# Altium project LPCB235__RLOOP__FCU.PrjPCB (part 6 of 7)

## Sheet LPCB235 - ASI RS485.SchDoc
size A3; Address1: Factory 10; Address2: 9-13 Dingley Avenue, Dandeong, VICTORIA 3175, AUSTRALIA; DocumentNumber: 3; Revision: 1; SheetNumber: 3; SheetTotal: 37; Lockie__PCB_SUB_ASSEMBLY: ASI RS485 Link; Lockie__PCB_ASSEMBLY: FCU PCB; Lockie__LDL: LPCB235; Lockie__PCB_DESCRIPTION: Flight Control Unit
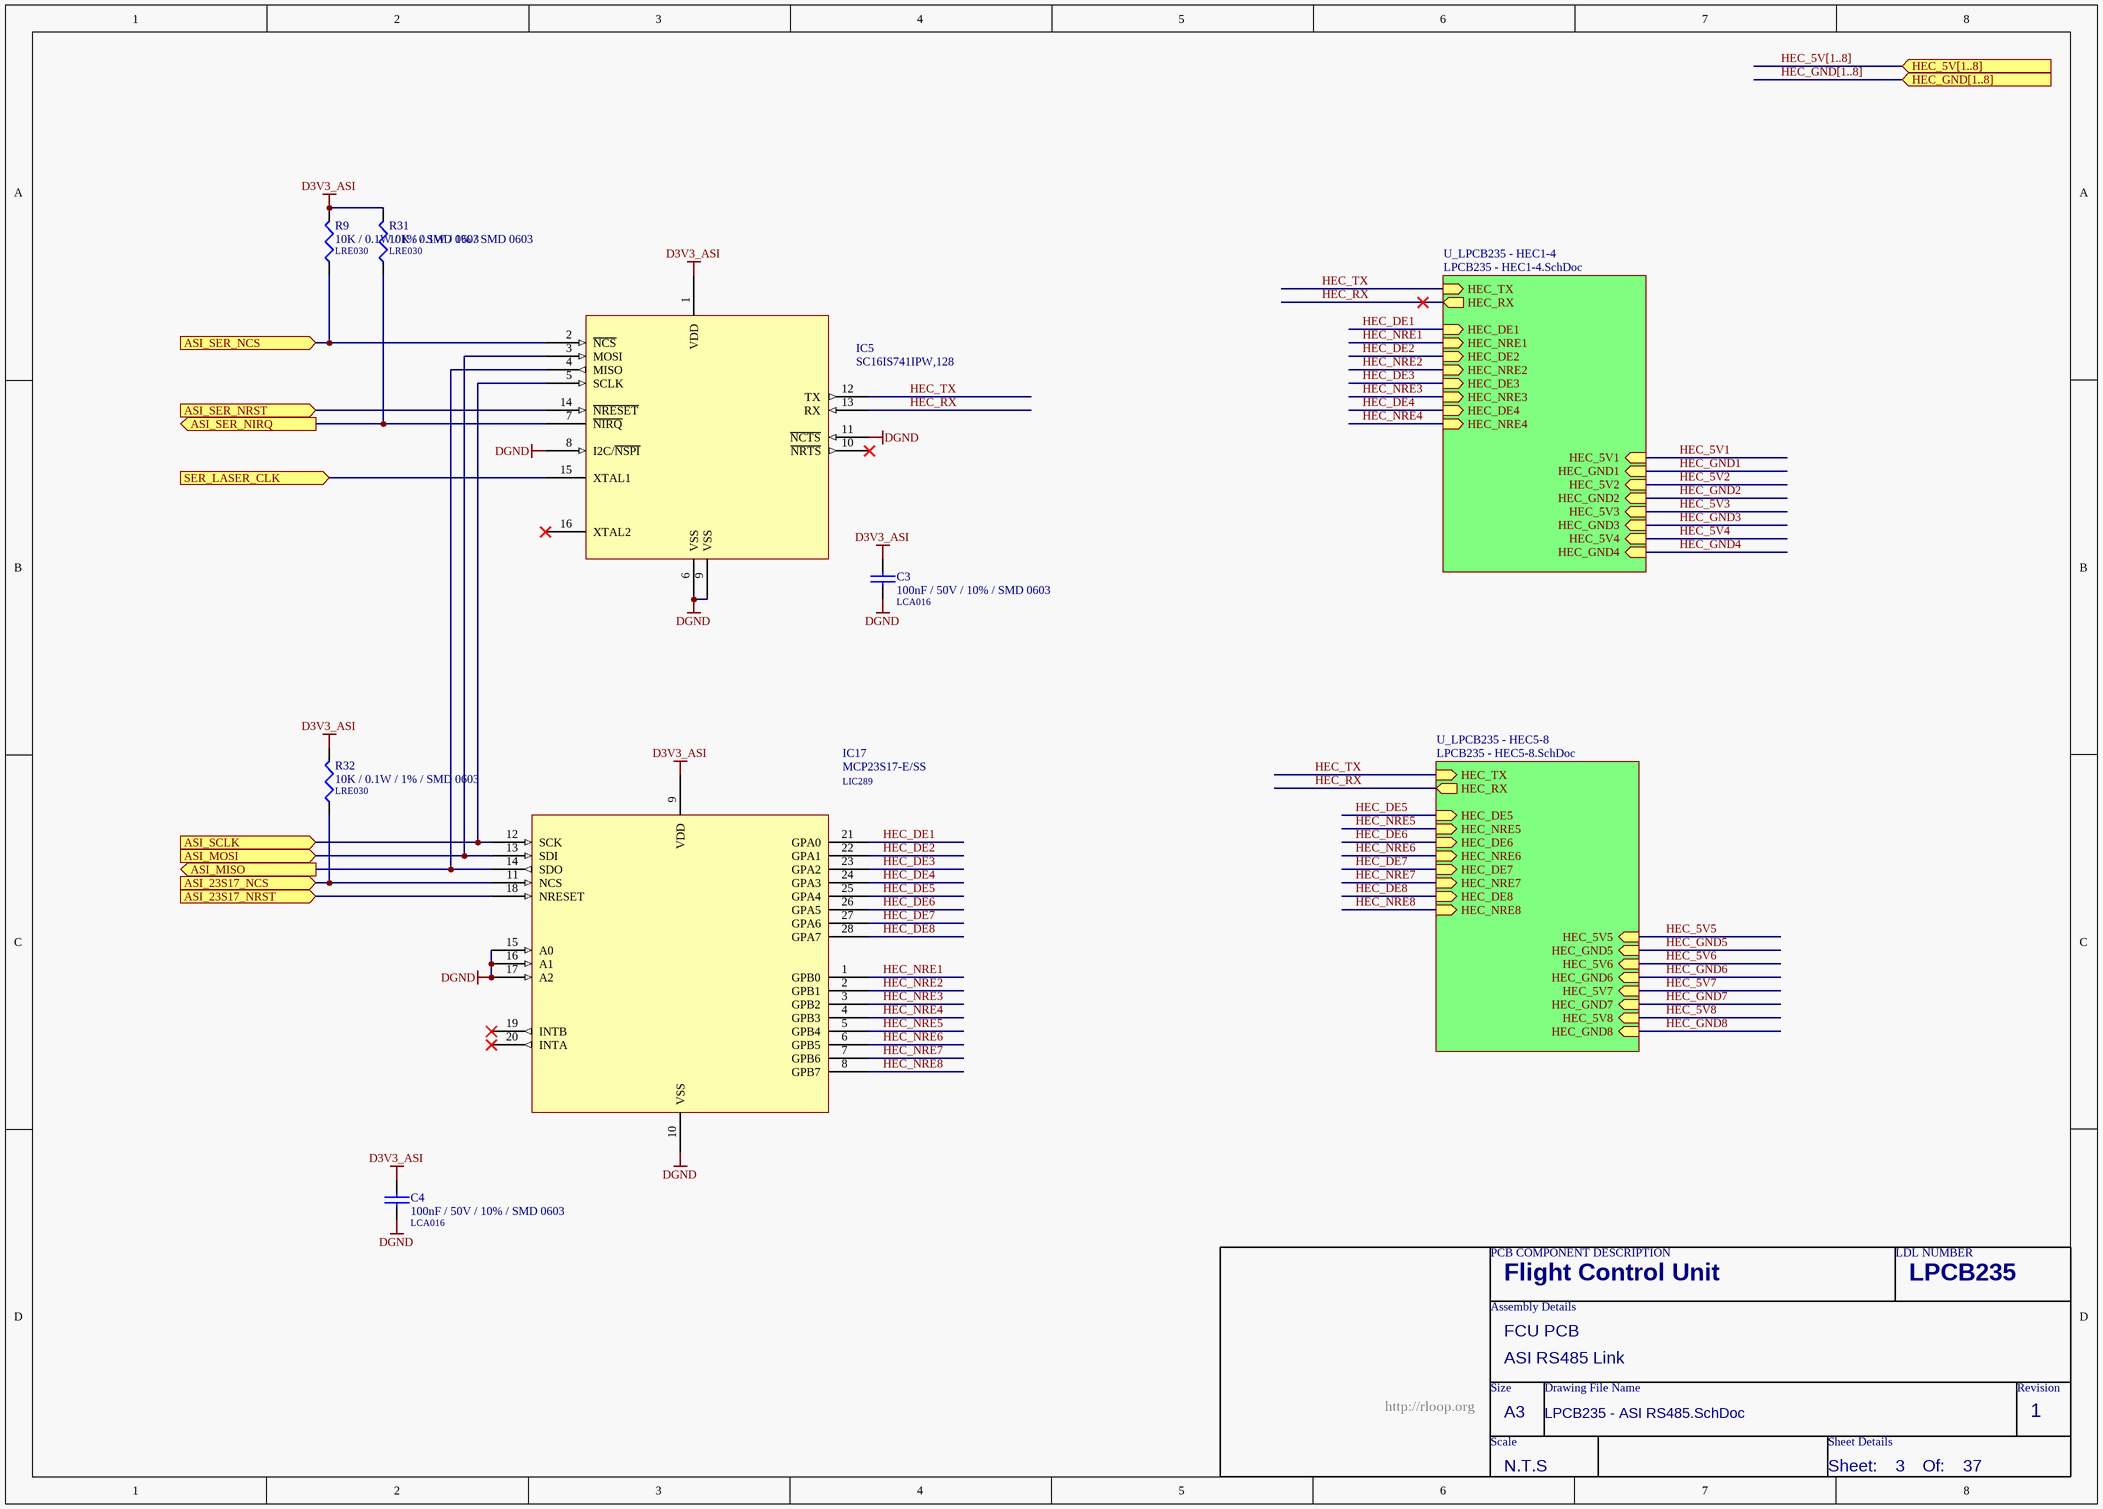
[diagram p34: LPCB235 - ASI RS485.SchDoc]

### Parts
C3  100nF / 50V / 10% / SMD 0603  LDL_NUMBER: LCA016  [LFP011__CC1608-0603-IPC7351_B]
C4  100nF / 50V / 10% / SMD 0603  LDL_NUMBER: LCA016  [LFP011__CC1608-0603-IPC7351_B]
IC5  SC16IS741IPW,128  [LFP049__TSSOP-16]
IC17  MCP23S17-E/SS  LDL_NUMBER: LIC289  [LFP050__SSOP28]
R9  10K / 0.1W / 1% / SMD 0603  LDL_NUMBER: LRE030  [LFP020__CR1608-0603-IPC7351_B]
R31  10K / 0.1W / 1% / SMD 0603  LDL_NUMBER: LRE030  [LFP020__CR1608-0603-IPC7351_B]
R32  10K / 0.1W / 1% / SMD 0603  LDL_NUMBER: LRE030  [LFP020__CR1608-0603-IPC7351_B]

### Sub-sheets
U_LPCB235 - HEC1-4 = LPCB235 - HEC1-4.SchDoc: HEC_RX (out), HEC_TX (in), HEC_DE1 (in), HEC_NRE1 (in), HEC_DE2 (in), HEC_NRE2 (in), HEC_DE3 (in), HEC_NRE3 (in), HEC_DE4 (in), HEC_NRE4 (in), HEC_5V1 (in), HEC_GND1 (in), HEC_5V2 (in), HEC_GND2 (in), HEC_5V3 (in), HEC_GND3 (in), HEC_5V4 (in), HEC_GND4 (in)
U_LPCB235 - HEC5-8 = LPCB235 - HEC5-8.SchDoc: HEC_RX (out), HEC_TX (in), HEC_DE5 (in), HEC_NRE5 (in), HEC_DE6 (in), HEC_NRE6 (in), HEC_DE7 (in), HEC_NRE7 (in), HEC_DE8 (in), HEC_NRE8 (in), HEC_5V5 (in), HEC_GND5 (in), HEC_5V6 (in), HEC_GND6 (in), HEC_5V7 (in), HEC_GND7 (in), HEC_5V8 (in), HEC_GND8 (in)

### Ports
ASI_23S17_NCS (in), ASI_23S17_NRST (in), ASI_MISO (out), ASI_MOSI (in), ASI_SCLK (in), ASI_SER_NCS (in), ASI_SER_NIRQ (out), ASI_SER_NRST (in), HEC_5V[1..8] (in), HEC_GND[1..8] (in), SER_LASER_CLK (in)

### Nets
D3V3_ASI: C3.1 C4.1 IC5.1(VDD) IC17.9(VDD) R9.2 R31.2 R32.2
DGND: C3.2 C4.2 IC5.6(VSS) IC5.8(I2C/~{NSPI}) IC5.9(VSS) IC5.11(~{NCTS}) IC17.10(VSS) IC17.15(A0) IC17.16(A1) IC17.17(A2)
ASI_23S17_NCS: IC17.11(NCS) R32.1 ; port ASI_23S17_NCS
ASI_23S17_NRST: IC17.18(NRESET) ; port ASI_23S17_NRST
ASI_MISO: IC5.4(MISO) IC17.14(SDO) ; port ASI_MISO
ASI_MOSI: IC5.3(MOSI) IC17.13(SDI) ; port ASI_MOSI
ASI_SCLK: IC5.5(SCLK) IC17.12(SCK) ; port ASI_SCLK
ASI_SER_NCS: IC5.2(~{NCS}) R9.1 ; port ASI_SER_NCS
ASI_SER_NIRQ: IC5.7(~{NIRQ}) R31.1 ; port ASI_SER_NIRQ
ASI_SER_NRST: IC5.14(~{NRESET}) ; port ASI_SER_NRST
HEC_DE1: IC17.21(GPA0) ; sheet U_LPCB235 - HEC1-4/HEC_DE1
HEC_DE2: IC17.22(GPA1) ; sheet U_LPCB235 - HEC1-4/HEC_DE2
HEC_DE3: IC17.23(GPA2) ; sheet U_LPCB235 - HEC1-4/HEC_DE3
HEC_DE4: IC17.24(GPA3) ; sheet U_LPCB235 - HEC1-4/HEC_DE4
HEC_DE5: IC17.25(GPA4) ; sheet U_LPCB235 - HEC5-8/HEC_DE5
HEC_DE6: IC17.26(GPA5) ; sheet U_LPCB235 - HEC5-8/HEC_DE6
HEC_DE7: IC17.27(GPA6) ; sheet U_LPCB235 - HEC5-8/HEC_DE7
HEC_DE8: IC17.28(GPA7) ; sheet U_LPCB235 - HEC5-8/HEC_DE8
HEC_NRE1: IC17.1(GPB0) ; sheet U_LPCB235 - HEC1-4/HEC_NRE1
HEC_NRE2: IC17.2(GPB1) ; sheet U_LPCB235 - HEC1-4/HEC_NRE2
HEC_NRE3: IC17.3(GPB2) ; sheet U_LPCB235 - HEC1-4/HEC_NRE3
HEC_NRE4: IC17.4(GPB3) ; sheet U_LPCB235 - HEC1-4/HEC_NRE4
HEC_NRE5: IC17.5(GPB4) ; sheet U_LPCB235 - HEC5-8/HEC_NRE5
HEC_NRE6: IC17.6(GPB5) ; sheet U_LPCB235 - HEC5-8/HEC_NRE6
HEC_NRE7: IC17.7(GPB6) ; sheet U_LPCB235 - HEC5-8/HEC_NRE7
HEC_NRE8: IC17.8(GPB7) ; sheet U_LPCB235 - HEC5-8/HEC_NRE8
HEC_RX: IC5.13(RX) ; sheet U_LPCB235 - HEC1-4/HEC_RX, sheet U_LPCB235 - HEC5-8/HEC_RX
HEC_TX: IC5.12(TX) ; sheet U_LPCB235 - HEC1-4/HEC_TX, sheet U_LPCB235 - HEC5-8/HEC_TX
SER_LASER_CLK: IC5.15(XTAL1) ; port SER_LASER_CLK

Not connected (* = marked no-connect by the designer): IC5 10(~{NRTS})* 16(XTAL2)*; IC17 19(INTB)* 20(INTA)*

### Buses and harness runs
bus HEC_5V[1..8] = port HEC_5V[1..8]
bus HEC_GND[1..8] = port HEC_GND[1..8]

### Notes on the sheet
- PCB COMPONENT DESCRIPTION
- LDL NUMBER
- Assembly Details
- Size
- Drawing File Name
- Revision
- http://rloop.org
- Scale
- A3
- Sheet Details
- N.T.S
- Sheet:
- Of:

### Library data of the parts
C3 C4 = 100nF / 50V / 10% / SMD 0603: as C113-C117 on sheet LPCB235 - SPI UART - GROUP B1; FMEDA__FUNCTION_IN_SYSTEM: *; FMEDA__OPERATING__VOLTAGE_TYP: 3.3
IC5 = SC16IS741IPW,128: as IC33 on sheet LPCB235 - SPI UART - GROUP B1; FMEDA__FUNCTION_IN_SYSTEM: *
IC17 = MCP23S17-E/SS: IC, SPI IO Expander, 16bit, SMD SSOP28 [LIC289]; FMEDA__OPERATING__TEMP_MIN: -20; FMEDA__OPERATING__TEMP_TYP: 27; FMEDA__OPERATING__TEMP_MAX: 50; FMEDA__OPERATING__VOLTAGE_MIN: 0; FMEDA__OPERATING__VOLTAGE_TYP: 3.3; FMEDA__CHANNEL: COM; FMEDA__FUNCTION_IN_SYSTEM: *; FMEDA__OPERATING__VOLTAGE_MAX: 3.3
R9 R31 R32 = 10K / 0.1W / 1% / SMD 0603: as R64 on sheet LPCB235 - SPI UART - GROUP B1; Value: 10K; FMEDA__OPERATING__POWER_MIN: 0; FMEDA__OPERATING__VOLTAGE_MAX: 0; FMEDA__OPERATING__VOLTAGE_MIN: 0; FMEDA__OPERATING__VOLTAGE_TYP: 0; FMEDA__FUNCTION_IN_SYSTEM: *

## Sheet LPCB235 - HEC1-4.SchDoc
size A3; Address1: Factory 10; Address2: 9-13 Dingley Avenue, Dandeong, VICTORIA 3175, AUSTRALIA; DocumentNumber: 4; Revision: 1; SheetNumber: 4; SheetTotal: 37; Lockie__PCB_SUB_ASSEMBLY: HEC 1-4; Lockie__PCB_ASSEMBLY: FCU PCB; Lockie__LDL: LPCB235; Lockie__PCB_DESCRIPTION: Flight Control Unit
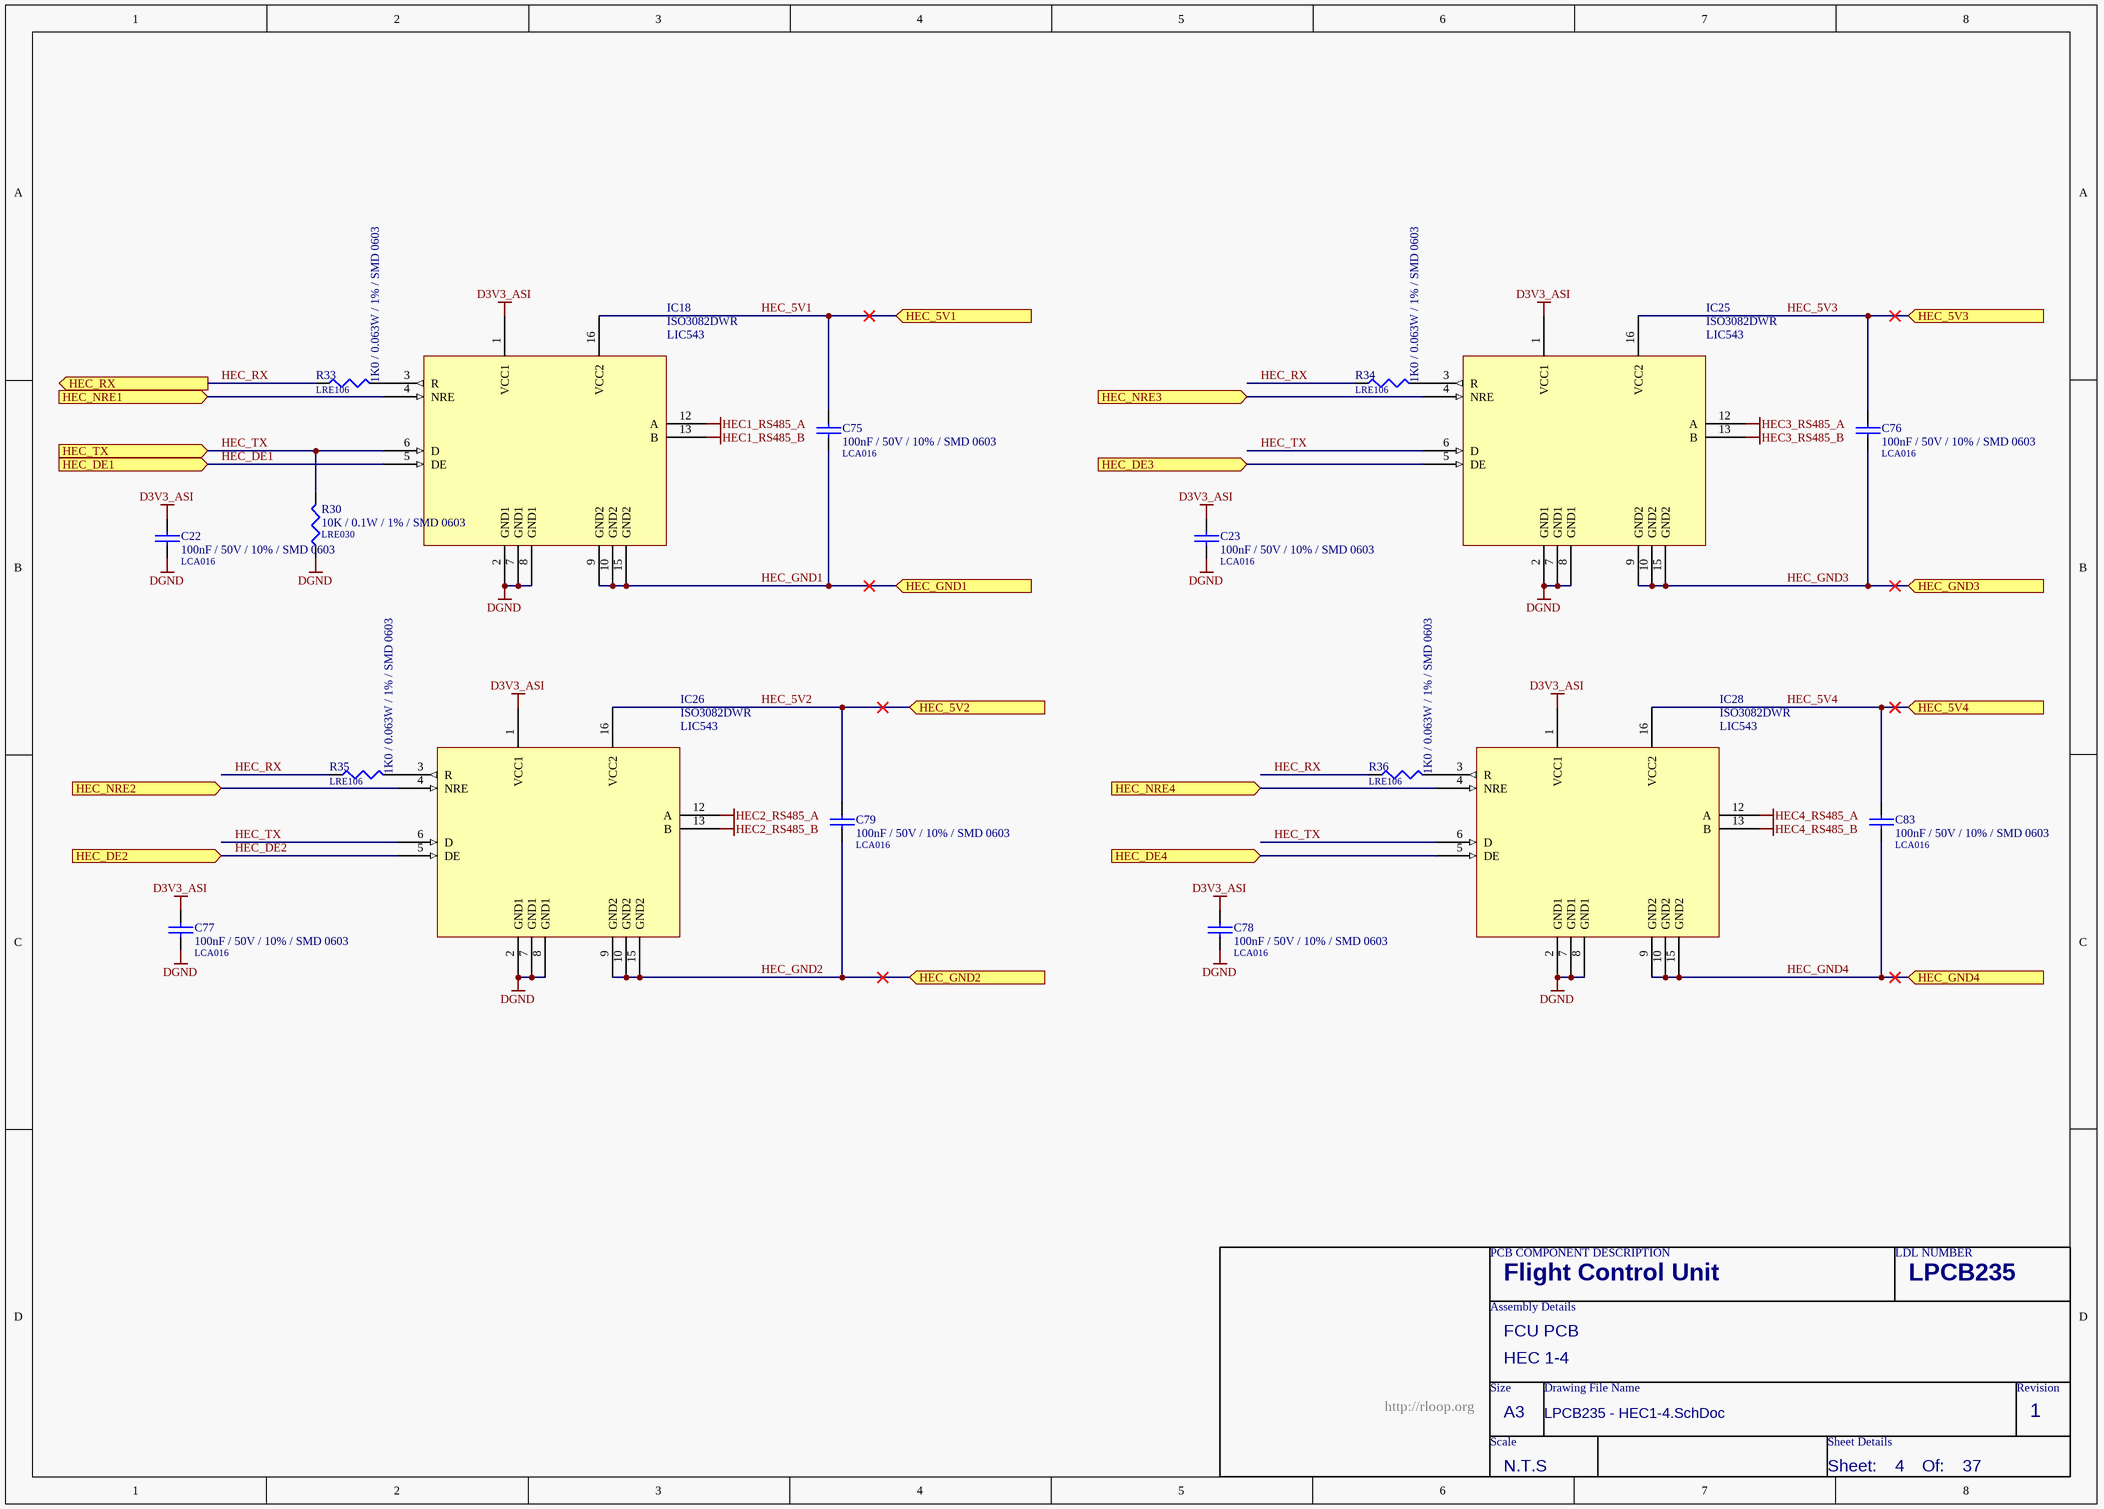
[diagram p35: LPCB235 - HEC1-4.SchDoc]

### Parts
C22  100nF / 50V / 10% / SMD 0603  LDL_NUMBER: LCA016  [LFP011__CC1608-0603-IPC7351_B]
C23  100nF / 50V / 10% / SMD 0603  LDL_NUMBER: LCA016  [LFP011__CC1608-0603-IPC7351_B]
C75  100nF / 50V / 10% / SMD 0603  LDL_NUMBER: LCA016  [LFP011__CC1608-0603-IPC7351_B]
C76  100nF / 50V / 10% / SMD 0603  LDL_NUMBER: LCA016  [LFP011__CC1608-0603-IPC7351_B]
C77  100nF / 50V / 10% / SMD 0603  LDL_NUMBER: LCA016  [LFP011__CC1608-0603-IPC7351_B]
C78  100nF / 50V / 10% / SMD 0603  LDL_NUMBER: LCA016  [LFP011__CC1608-0603-IPC7351_B]
C79  100nF / 50V / 10% / SMD 0603  LDL_NUMBER: LCA016  [LFP011__CC1608-0603-IPC7351_B]
C83  100nF / 50V / 10% / SMD 0603  LDL_NUMBER: LCA016  [LFP011__CC1608-0603-IPC7351_B]
IC18  ISO3082DWR  LDL_NUMBER: LIC543  [LFP068__SO-G16/G6.9]
IC25  ISO3082DWR  LDL_NUMBER: LIC543  [LFP068__SO-G16/G6.9]
IC26  ISO3082DWR  LDL_NUMBER: LIC543  [LFP068__SO-G16/G6.9]
IC28  ISO3082DWR  LDL_NUMBER: LIC543  [LFP068__SO-G16/G6.9]
R30  10K / 0.1W / 1% / SMD 0603  LDL_NUMBER: LRE030  [LFP020__CR1608-0603-IPC7351_B]
R33  1K0 / 0.063W / 1% / SMD 0603  LDL_NUMBER: LRE106  [LFP020__CR1608-0603-IPC7351_B]
R34  1K0 / 0.063W / 1% / SMD 0603  LDL_NUMBER: LRE106  [LFP020__CR1608-0603-IPC7351_B]
R35  1K0 / 0.063W / 1% / SMD 0603  LDL_NUMBER: LRE106  [LFP020__CR1608-0603-IPC7351_B]
R36  1K0 / 0.063W / 1% / SMD 0603  LDL_NUMBER: LRE106  [LFP020__CR1608-0603-IPC7351_B]

### Ports
HEC_5V1 (in), HEC_5V2 (in), HEC_5V3 (in), HEC_5V4 (in), HEC_DE1 (in), HEC_DE2 (in), HEC_DE3 (in), HEC_DE4 (in), HEC_GND1 (in), HEC_GND2 (in), HEC_GND3 (in), HEC_GND4 (in), HEC_NRE1 (in), HEC_NRE2 (in), HEC_NRE3 (in), HEC_NRE4 (in), HEC_RX (out), HEC_TX (in)

### Nets
D3V3_ASI: C22.1 C23.1 C77.1 C78.1 IC18.1(VCC1) IC25.1(VCC1) IC26.1(VCC1) IC28.1(VCC1)
DGND: C22.2 C23.2 C77.2 C78.2 IC18.2(GND1) IC18.7(GND1) IC18.8(GND1) IC25.2(GND1) IC25.7(GND1) IC25.8(GND1) IC26.2(GND1) IC26.7(GND1) IC26.8(GND1) IC28.2(GND1) IC28.7(GND1) IC28.8(GND1) R30.1
HEC1_RS485_A: IC18.12(A)
HEC1_RS485_B: IC18.13(B)
HEC2_RS485_A: IC26.12(A)
HEC2_RS485_B: IC26.13(B)
HEC3_RS485_A: IC25.12(A)
HEC3_RS485_B: IC25.13(B)
HEC4_RS485_A: IC28.12(A)
HEC4_RS485_B: IC28.13(B)
HEC_5V1: C75.1 IC18.16(VCC2) ; port HEC_5V1
HEC_5V2: C79.1 IC26.16(VCC2) ; port HEC_5V2
HEC_5V3: C76.1 IC25.16(VCC2) ; port HEC_5V3
HEC_5V4: C83.1 IC28.16(VCC2) ; port HEC_5V4
HEC_DE1: IC18.5(DE) ; port HEC_DE1
HEC_DE2: IC26.5(DE) ; port HEC_DE2
HEC_DE3: IC25.5(DE) ; port HEC_DE3
HEC_DE4: IC28.5(DE) ; port HEC_DE4
HEC_GND1: C75.2 IC18.9(GND2) IC18.10(GND2) IC18.15(GND2) ; port HEC_GND1
HEC_GND2: C79.2 IC26.9(GND2) IC26.10(GND2) IC26.15(GND2) ; port HEC_GND2
HEC_GND3: C76.2 IC25.9(GND2) IC25.10(GND2) IC25.15(GND2) ; port HEC_GND3
HEC_GND4: C83.2 IC28.9(GND2) IC28.10(GND2) IC28.15(GND2) ; port HEC_GND4
HEC_NRE1: IC18.4(NRE) ; port HEC_NRE1
HEC_NRE2: IC26.4(NRE) ; port HEC_NRE2
HEC_NRE3: IC25.4(NRE) ; port HEC_NRE3
HEC_NRE4: IC28.4(NRE) ; port HEC_NRE4
HEC_RX: R33.1 R34.1 R35.1 R36.1 ; port HEC_RX
HEC_TX: IC18.6(D) IC25.6(D) IC26.6(D) IC28.6(D) R30.2 ; port HEC_TX
NetIC18_3: IC18.3(R) R33.2
NetIC25_3: IC25.3(R) R34.2
NetIC26_3: IC26.3(R) R35.2
NetIC28_3: IC28.3(R) R36.2

### Notes on the sheet
- PCB COMPONENT DESCRIPTION
- LDL NUMBER
- Assembly Details
- Size
- Drawing File Name
- Revision
- http://rloop.org
- Scale
- A3
- Sheet Details
- N.T.S
- Sheet:
- Of:

### Library data of the parts
C22 C23 C75-C79 C83 = 100nF / 50V / 10% / SMD 0603: as C113-C117 on sheet LPCB235 - SPI UART - GROUP B1; FMEDA__FUNCTION_IN_SYSTEM: *; FMEDA__OPERATING__VOLTAGE_TYP: 3.3
IC18 IC25 IC26 IC28 = ISO3082DWR: IC, RS485 Isolator, SMD SOIC 16 [LIC543]
R30 = 10K / 0.1W / 1% / SMD 0603: as R64 on sheet LPCB235 - SPI UART - GROUP B1; Value: 10K; FMEDA__OPERATING__POWER_MIN: 0; FMEDA__OPERATING__VOLTAGE_MAX: 0; FMEDA__OPERATING__VOLTAGE_MIN: 0; FMEDA__OPERATING__VOLTAGE_TYP: 0; FMEDA__FUNCTION_IN_SYSTEM: *
R33-R36 = 1K0 / 0.063W / 1% / SMD 0603: Resistor, Ceramic Chip, 1K0, 0.063W, 1%, SMD 0603 [LRE106]; Value: 1K; FMEDA__OPERATING__POWER_MAX: 0; FMEDA__OPERATING__TEMP_MAX: 50; FMEDA__OPERATING__TEMP_MIN: -20; FMEDA__OPERATING__TEMP_TYP: 27; FMEDA__CHANNEL: COM; FMEDA__OPERATING__POWER_MIN: 0; FMEDA__OPERATING__VOLTAGE_MAX: 0; FMEDA__OPERATING__VOLTAGE_MIN: 0; FMEDA__OPERATING__VOLTAGE_TYP: 0; FMEDA__FUNCTION_IN_SYSTEM: *

## Sheet LPCB235 - HEC5-8.SchDoc
size A3; Address1: Factory 10; Address2: 9-13 Dingley Avenue, Dandeong, VICTORIA 3175, AUSTRALIA; DocumentNumber: 5; Revision: 1; SheetNumber: 5; SheetTotal: 37; Lockie__PCB_SUB_ASSEMBLY: HEC 5-8; Lockie__PCB_ASSEMBLY: FCU PCB; Lockie__LDL: LPCB235; Lockie__PCB_DESCRIPTION: Flight Control Unit
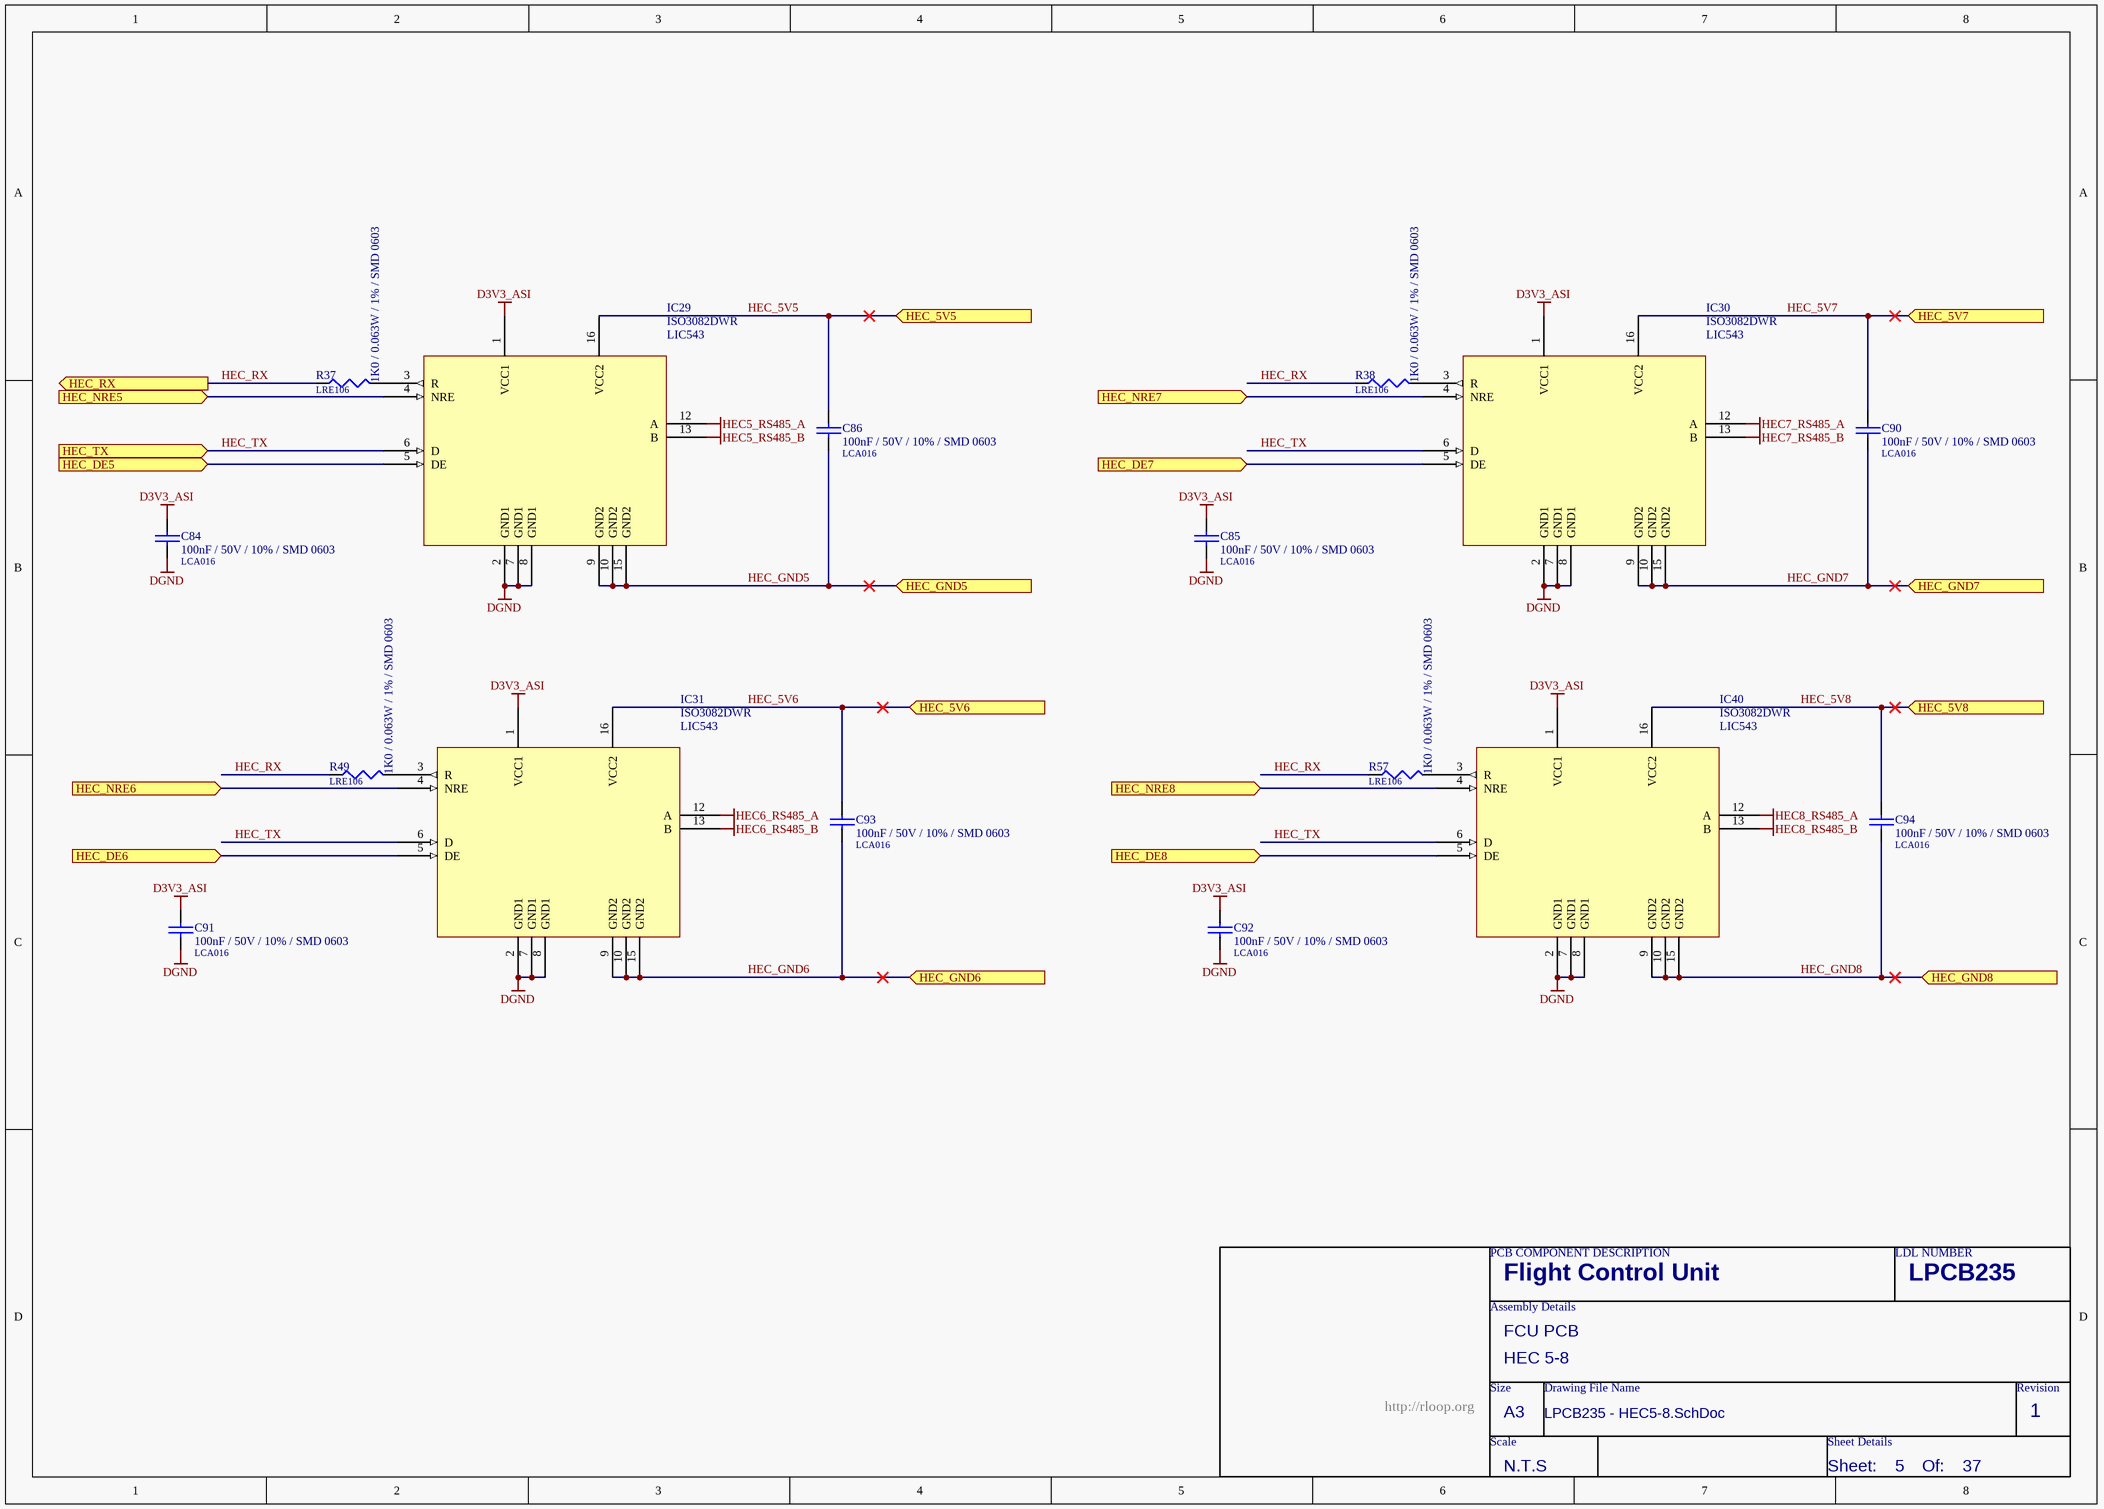
[diagram p36: LPCB235 - HEC5-8.SchDoc]

### Parts
C84  100nF / 50V / 10% / SMD 0603  LDL_NUMBER: LCA016  [LFP011__CC1608-0603-IPC7351_B]
C85  100nF / 50V / 10% / SMD 0603  LDL_NUMBER: LCA016  [LFP011__CC1608-0603-IPC7351_B]
C86  100nF / 50V / 10% / SMD 0603  LDL_NUMBER: LCA016  [LFP011__CC1608-0603-IPC7351_B]
C90  100nF / 50V / 10% / SMD 0603  LDL_NUMBER: LCA016  [LFP011__CC1608-0603-IPC7351_B]
C91  100nF / 50V / 10% / SMD 0603  LDL_NUMBER: LCA016  [LFP011__CC1608-0603-IPC7351_B]
C92  100nF / 50V / 10% / SMD 0603  LDL_NUMBER: LCA016  [LFP011__CC1608-0603-IPC7351_B]
C93  100nF / 50V / 10% / SMD 0603  LDL_NUMBER: LCA016  [LFP011__CC1608-0603-IPC7351_B]
C94  100nF / 50V / 10% / SMD 0603  LDL_NUMBER: LCA016  [LFP011__CC1608-0603-IPC7351_B]
IC29  ISO3082DWR  LDL_NUMBER: LIC543  [LFP068__SO-G16/G6.9]
IC30  ISO3082DWR  LDL_NUMBER: LIC543  [LFP068__SO-G16/G6.9]
IC31  ISO3082DWR  LDL_NUMBER: LIC543  [LFP068__SO-G16/G6.9]
IC40  ISO3082DWR  LDL_NUMBER: LIC543  [LFP068__SO-G16/G6.9]
R37  1K0 / 0.063W / 1% / SMD 0603  LDL_NUMBER: LRE106  [LFP020__CR1608-0603-IPC7351_B]
R38  1K0 / 0.063W / 1% / SMD 0603  LDL_NUMBER: LRE106  [LFP020__CR1608-0603-IPC7351_B]
R49  1K0 / 0.063W / 1% / SMD 0603  LDL_NUMBER: LRE106  [LFP020__CR1608-0603-IPC7351_B]
R57  1K0 / 0.063W / 1% / SMD 0603  LDL_NUMBER: LRE106  [LFP020__CR1608-0603-IPC7351_B]

### Ports
HEC_5V5 (in), HEC_5V6 (in), HEC_5V7 (in), HEC_5V8 (in), HEC_DE5 (in), HEC_DE6 (in), HEC_DE7 (in), HEC_DE8 (in), HEC_GND5 (in), HEC_GND6 (in), HEC_GND7 (in), HEC_GND8 (in), HEC_NRE5 (in), HEC_NRE6 (in), HEC_NRE7 (in), HEC_NRE8 (in), HEC_RX (out), HEC_TX (in)

### Nets
D3V3_ASI: C84.1 C85.1 C91.1 C92.1 IC29.1(VCC1) IC30.1(VCC1) IC31.1(VCC1) IC40.1(VCC1)
DGND: C84.2 C85.2 C91.2 C92.2 IC29.2(GND1) IC29.7(GND1) IC29.8(GND1) IC30.2(GND1) IC30.7(GND1) IC30.8(GND1) IC31.2(GND1) IC31.7(GND1) IC31.8(GND1) IC40.2(GND1) IC40.7(GND1) IC40.8(GND1)
HEC5_RS485_A: IC29.12(A)
HEC5_RS485_B: IC29.13(B)
HEC6_RS485_A: IC31.12(A)
HEC6_RS485_B: IC31.13(B)
HEC7_RS485_A: IC30.12(A)
HEC7_RS485_B: IC30.13(B)
HEC8_RS485_A: IC40.12(A)
HEC8_RS485_B: IC40.13(B)
HEC_5V5: C86.1 IC29.16(VCC2) ; port HEC_5V5
HEC_5V6: C93.1 IC31.16(VCC2) ; port HEC_5V6
HEC_5V7: C90.1 IC30.16(VCC2) ; port HEC_5V7
HEC_5V8: C94.1 IC40.16(VCC2) ; port HEC_5V8
HEC_DE5: IC29.5(DE) ; port HEC_DE5
HEC_DE6: IC31.5(DE) ; port HEC_DE6
HEC_DE7: IC30.5(DE) ; port HEC_DE7
HEC_DE8: IC40.5(DE) ; port HEC_DE8
HEC_GND5: C86.2 IC29.9(GND2) IC29.10(GND2) IC29.15(GND2) ; port HEC_GND5
HEC_GND6: C93.2 IC31.9(GND2) IC31.10(GND2) IC31.15(GND2) ; port HEC_GND6
HEC_GND7: C90.2 IC30.9(GND2) IC30.10(GND2) IC30.15(GND2) ; port HEC_GND7
HEC_GND8: C94.2 IC40.9(GND2) IC40.10(GND2) IC40.15(GND2) ; port HEC_GND8
HEC_NRE5: IC29.4(NRE) ; port HEC_NRE5
HEC_NRE6: IC31.4(NRE) ; port HEC_NRE6
HEC_NRE7: IC30.4(NRE) ; port HEC_NRE7
HEC_NRE8: IC40.4(NRE) ; port HEC_NRE8
HEC_RX: R37.1 R38.1 R49.1 R57.1 ; port HEC_RX
HEC_TX: IC29.6(D) IC30.6(D) IC31.6(D) IC40.6(D) ; port HEC_TX
NetIC29_3: IC29.3(R) R37.2
NetIC30_3: IC30.3(R) R38.2
NetIC31_3: IC31.3(R) R49.2
NetIC40_3: IC40.3(R) R57.2

### Notes on the sheet
- PCB COMPONENT DESCRIPTION
- LDL NUMBER
- Assembly Details
- Size
- Drawing File Name
- Revision
- http://rloop.org
- Scale
- A3
- Sheet Details
- N.T.S
- Sheet:
- Of:

### Library data of the parts
C84-C86 C90-C94 = 100nF / 50V / 10% / SMD 0603: as C113-C117 on sheet LPCB235 - SPI UART - GROUP B1; FMEDA__FUNCTION_IN_SYSTEM: *; FMEDA__OPERATING__VOLTAGE_TYP: 3.3
IC29-IC31 IC40 = ISO3082DWR: IC, RS485 Isolator, SMD SOIC 16 [LIC543]
R37 R38 R49 R57 = 1K0 / 0.063W / 1% / SMD 0603: as R33 on sheet LPCB235 - HEC1-4; FMEDA__OPERATING__POWER_MIN: 0; FMEDA__OPERATING__VOLTAGE_MAX: 0; FMEDA__OPERATING__VOLTAGE_MIN: 0; FMEDA__OPERATING__VOLTAGE_TYP: 0; FMEDA__FUNCTION_IN_SYSTEM: *